# EasyEDA schematic CI_iCESDuck-ShieldControler.json

## Sheets
1 Connectors: TITLE: Connectors; REV: 1.0; Date: 2023-12-20; Sheet: 0/6; Drawn By: Daniel Fuentes Morales; Company: iCESDuck
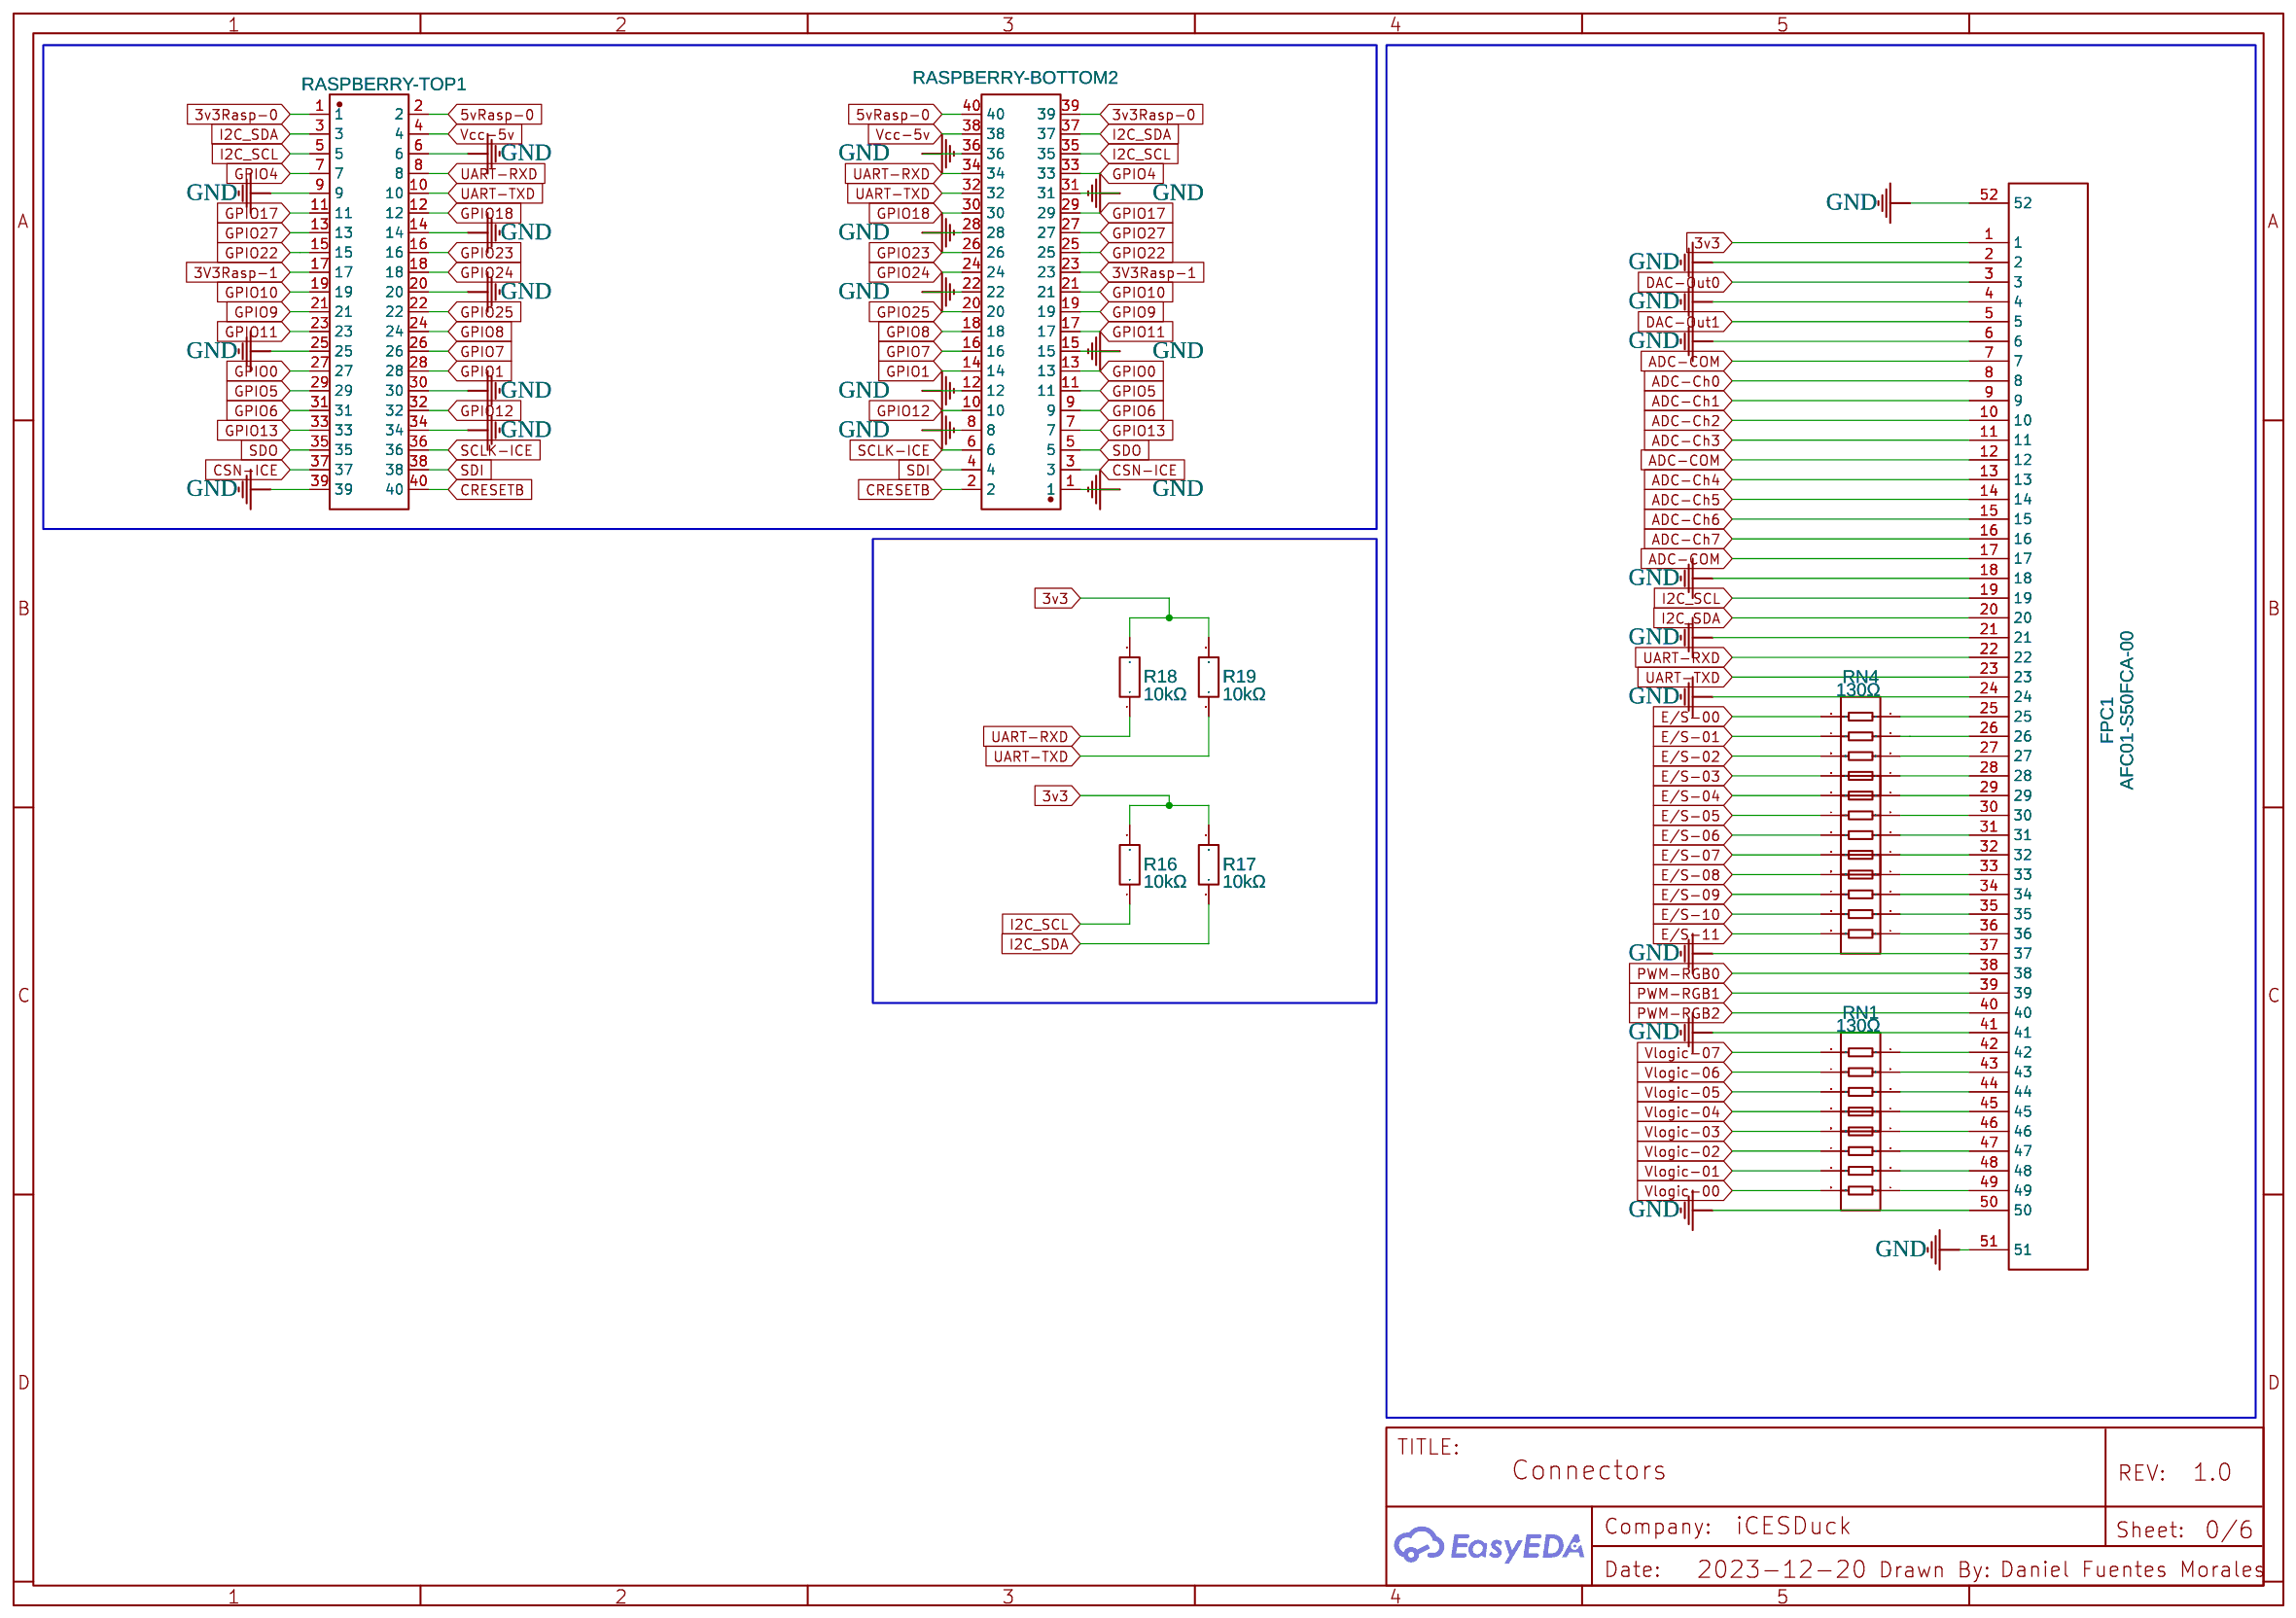
[diagram p0: Connectors]
2 power supply: TITLE: Power Supply; Date: 2023-12-21; Sheet: 1/1
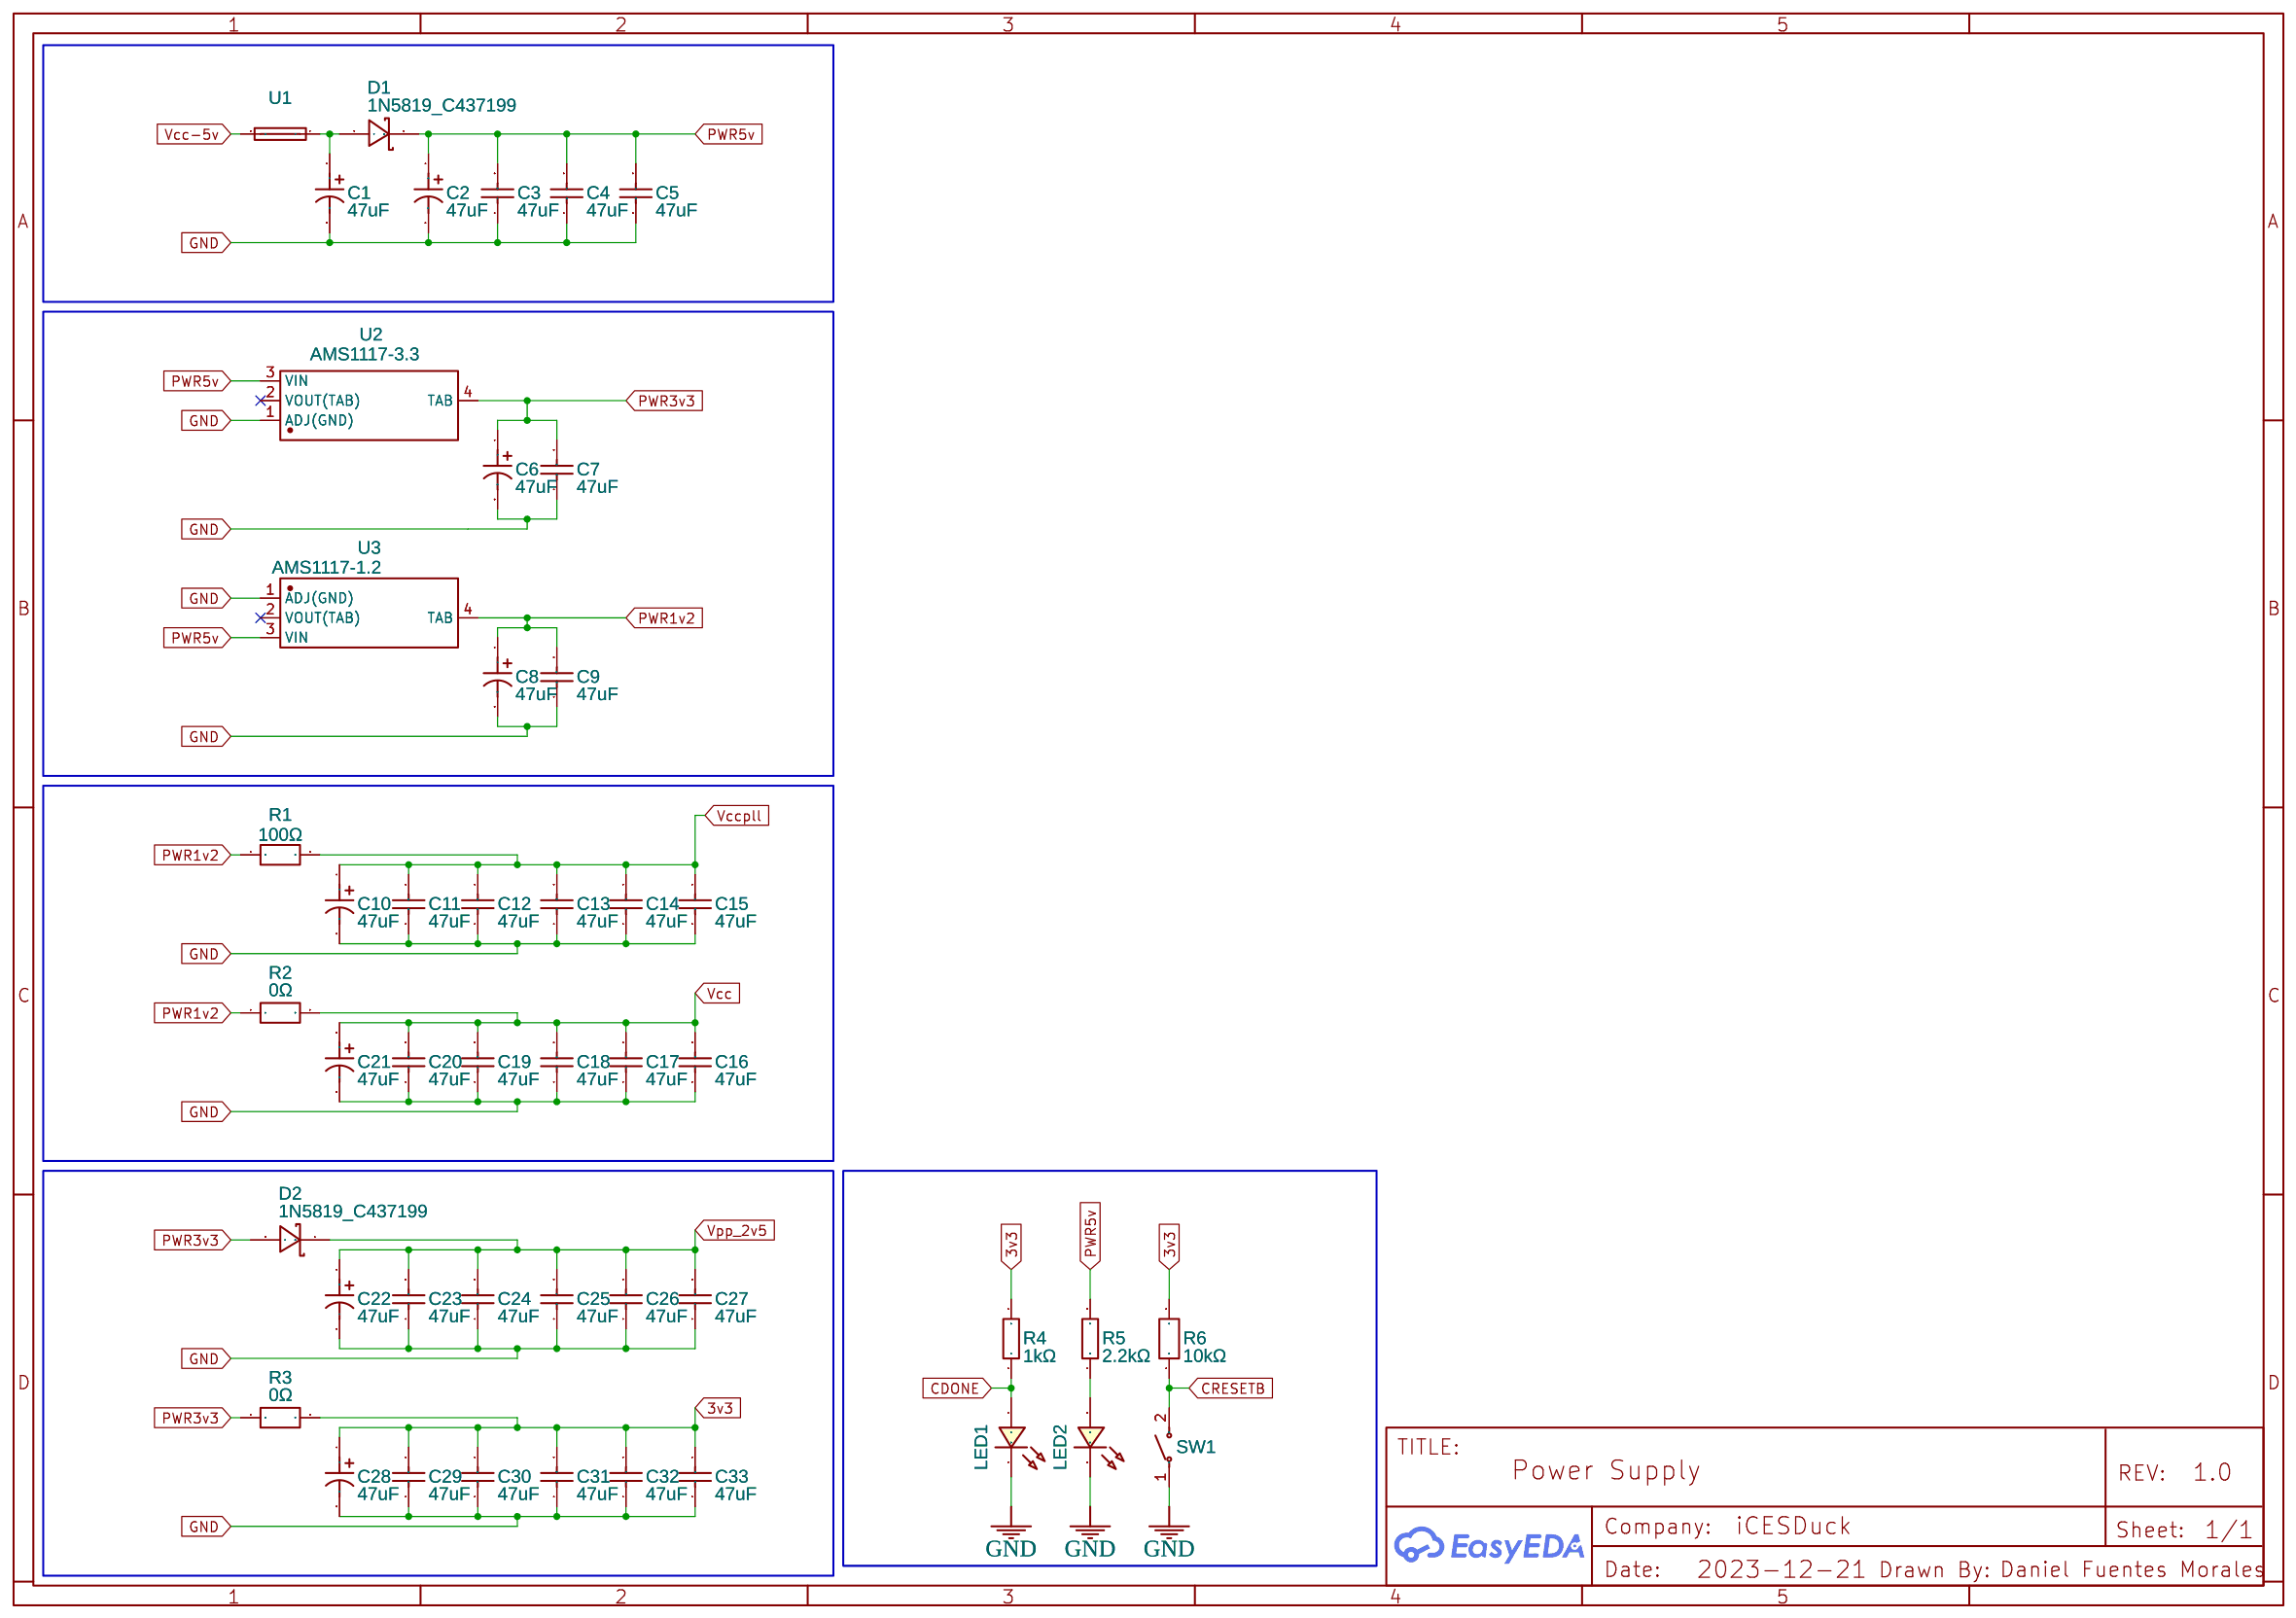
[diagram p1: power supply]
3 FPGA - iCE40UP5k: TITLE: FPGA - iCE40UP5K; Date: 2023-12-21; Sheet: 1/1
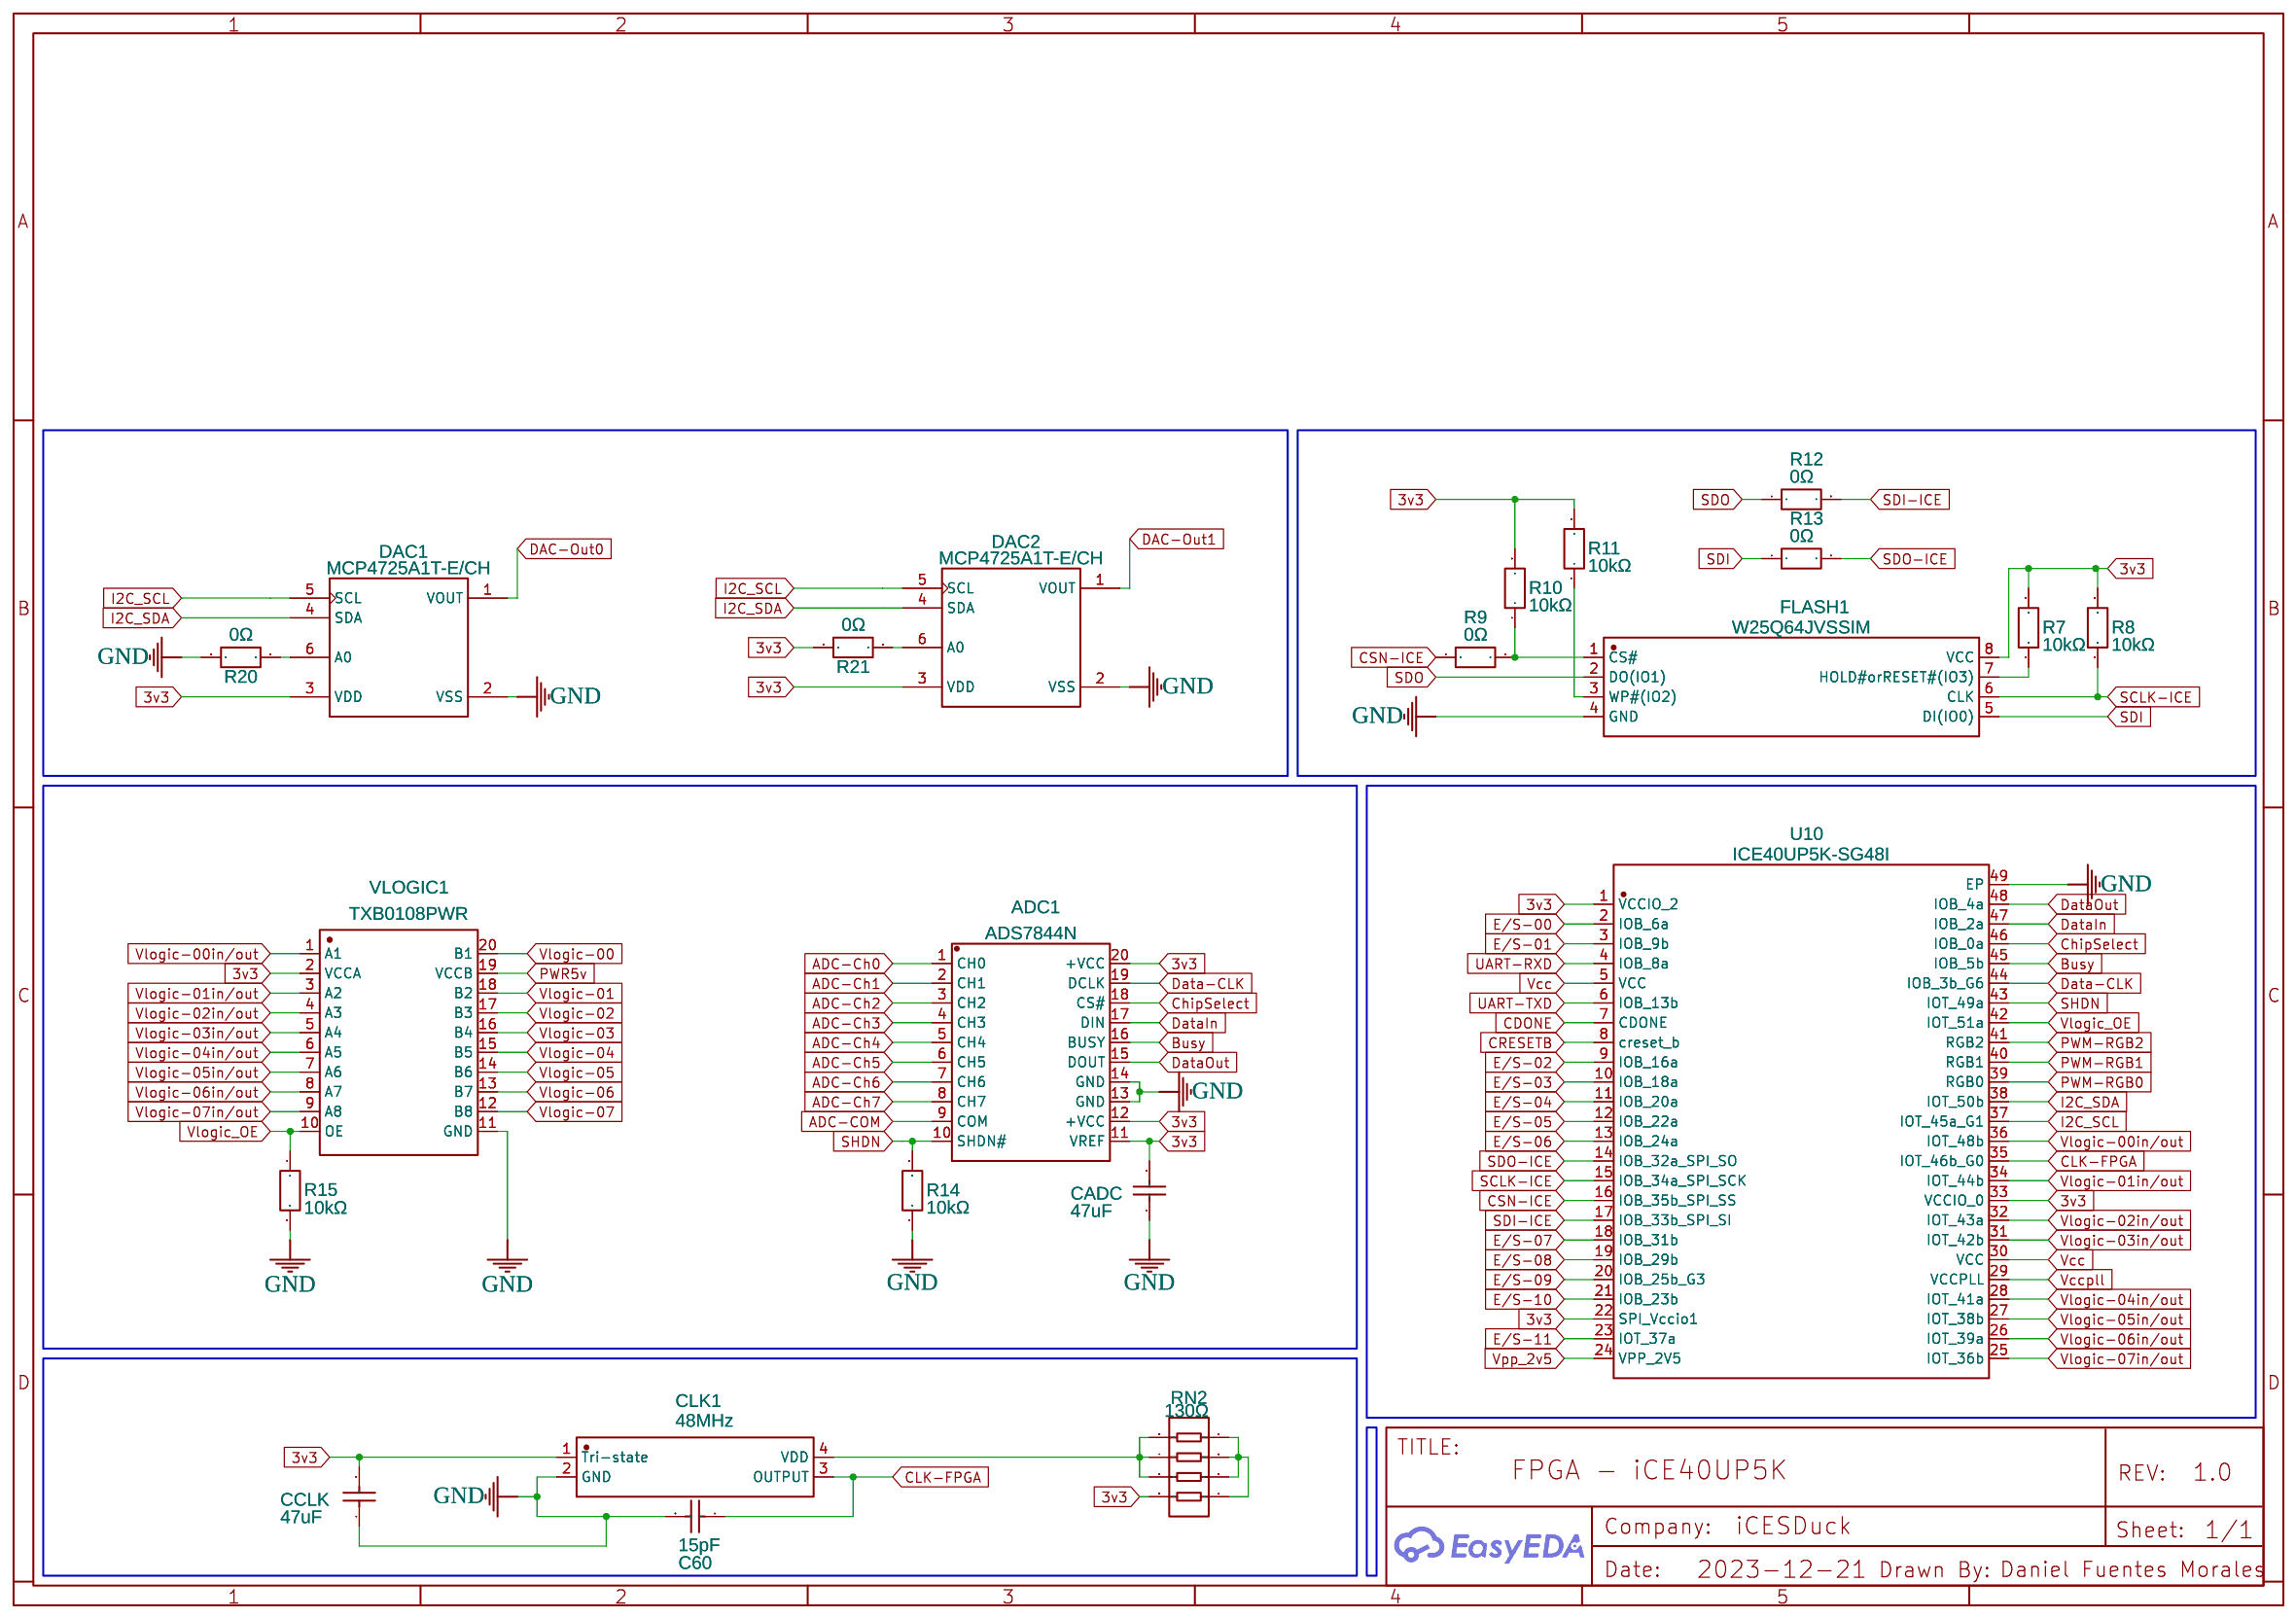
[diagram p2: FPGA - iCE40UP5k]

## Parts
sheet Connectors
FPC1  AFC01-S50FCA-00  [FPC-SMD_AFC01-S50FCC-00]
R16  10kΩ  [R1206]
R17  10kΩ  [R1206]
R18  10kΩ  [R1206]
R19  10kΩ  [R1206]
RASPBERRY-BOTTOM2  FH-00148  [HDR-SMD_40P-P2.54-V-F-R2-C20-S7.1-EH]
RASPBERRY-TOP1  FH-00148  [HDR-SMD_40P-P2.54-V-F-R2-C20-S7.1-EH]
RN1  130Ω  [RES-ARRAY-SMD_0603-8P-L3.2-W1.6-BL]
RN3  130Ω  [RES-ARRAY-SMD_0603-8P-L3.2-W1.6-BL]
RN4  130Ω  [RES-ARRAY-SMD_0603-8P-L3.2-W1.6-BL]
RN5  130Ω  [RES-ARRAY-SMD_0603-8P-L3.2-W1.6-BL]
RN6  130Ω  [RES-ARRAY-SMD_0603-8P-L3.2-W1.6-BL]
sheet FPGA - iCE40UP5k
ADC1  ADS7844N  [SSOP-20_L7.2-W5.3-P0.65-LS7.8-BL]
C60  15pF  [C0603]
CADC  47uF  [C0805]
CCLK  47uF  [C0805]
CLK1  48MHz  [OSC-SMD_4P-L3.2-W2.5-BL_SIT8008BI]
DAC1  MCP4725A1T-E/CH  [SOT-23-6_L2.9-W1.6-P0.95-LS2.8-BR]
DAC2  MCP4725A1T-E/CH  [SOT-23-6_L2.9-W1.6-P0.95-LS2.8-BR]
FLASH1  W25Q64JVSSIM  [SOIC-8_L5.2-W5.2-P1.27-LS8.0-BL]
R7  10kΩ  [R1206]
R8  10kΩ  [R1206]
R9  0Ω  [R0805]
R10  10kΩ  [R1206]
R11  10kΩ  [R1206]
R12  0Ω  [R0805]
R13  0Ω  [R0805]
R14  10kΩ  [R1206]
R15  10kΩ  [R1206]
R20  0Ω  [R0805]
R21  0Ω  [R0805]
RN2  130Ω  [RES-ARRAY-SMD_0603-8P-L3.2-W1.6-BL]
U10  ICE40UP5K-SG48I  [QFN-48_L7.0-W7.0-P0.50-TL-EP5.4-1]
VLOGIC1  TXB0108PWR  [TSSOP-20_L6.5-W4.4-P0.65-LS6.4-BL]
sheet power supply
C1  47uF  [CAP-SMD_L3.2-W1.6]
C2  47uF  [CAP-SMD_L3.2-W1.6]
C3  47uF  [C0805]
C4  47uF  [C0805]
C5  47uF  [C0805]
C6  47uF  [CAP-SMD_L3.2-W1.6]
C7  47uF  [C0805]
C8  47uF  [CAP-SMD_L3.2-W1.6]
C9  47uF  [C0805]
C10  47uF  [CAP-SMD_L3.2-W1.6]
C11  47uF  [C0805]
C12  47uF  [C0805]
C13  47uF  [C0805]
C14  47uF  [C0805]
C15  47uF  [C0805]
C16  47uF  [C0805]
C17  47uF  [C0805]
C18  47uF  [C0805]
C19  47uF  [C0805]
C20  47uF  [C0805]
C21  47uF  [CAP-SMD_L3.2-W1.6]
C22  47uF  [CAP-SMD_L3.2-W1.6]
C23  47uF  [C0805]
C24  47uF  [C0805]
C25  47uF  [C0805]
C26  47uF  [C0805]
C27  47uF  [C0805]
C28  47uF  [CAP-SMD_L3.2-W1.6]
C29  47uF  [C0805]
C30  47uF  [C0805]
C31  47uF  [C0805]
C32  47uF  [C0805]
C33  47uF  [C0805]
D1  1N5819_C437199  [SMA_L4.4-W2.6-LS5.0-RD]
D2  1N5819_C437199  [SMA_L4.4-W2.6-LS5.0-RD]
LED1  LED-0603_G  [LED0603_GREEN]
LED2  LED-0603_G  [LED0603_GREEN]
R1  100Ω  [R0805]
R2  0Ω  [R0805]
R3  0Ω  [R0805]
R4  1kΩ  [R0603]
R5  2.2kΩ  [R0603]
R6  10kΩ  [R1206]
SW1  TS-1088R-02026  [SW-SMD_L3.9-W3.0-P4.45]
U1  0494001.NR  [F0603]
U2  AMS1117-3.3  [SOT-223-4_L6.5-W3.5-P2.30-LS7.0-BR]
U3  AMS1117-1.2  [SOT-223_L6.7-W3.5-P2.30-BR]

## Library data of the parts
FPC1 = AFC01-S50FCA-00: Contributor: LCSC; Supplier: LCSC; Supplier Part: C262676; Manufacturer: JS(钜硕电子); JLCPCB Part Class: Extended Part; link: https://lcsc.com/eda_search?q=C262676&%26type=1&ref=editor
R6-R8 R10 R11 R14-R19 = FRP1206J103 TS: Contributor: lcsc; Supplier: LCSC; Supplier Part: C3013377; Manufacturer: FOJAN(富捷); link: https://lcsc.com/eda_search?q=C3013377&%26type=1&ref=editor
RASPBERRY-BOTTOM2 RASPBERRY-TOP1 = FH-00148: Contributor: LCSC; Supplier: LCSC; Supplier Part: C2685092; Manufacturer: Liansheng(连盛); JLCPCB Part Class: Extended Part; link: https://lcsc.com/eda_search?q=C2685092&%26type=1&ref=editor
RN1-RN6 = 4D03WGJ0131T5E: Contributor: LCSC; Supplier: LCSC; Supplier Part: C425191; Manufacturer: UNI-ROYAL(厚声); JLCPCB Part Class: Extended Part; link: https://lcsc.com/eda_search?q=C425191&%26type=1&ref=editor
ADC1 = ADS7844N: Contributor: LCSC; Supplier: LCSC; Supplier Part: C52610; Manufacturer: TI(德州仪器); JLCPCB Part Class: Extended Part; link: https://lcsc.com/eda_search?q=C52610&%26type=1&ref=editor
C60 = CL10C150JB8NNNC: Supplier: LCSC; Manufacturer: SAMSUNG(三星); Supplier Part: C1644; JLCPCB Part Class: Basic Part; link: https://lcsc.com/eda_search?q=C1644&%26type=1&ref=editor
C3-C5 C7 C9 C11-C20 C23-C27 C29-C33 CADC CCLK = C2012X5R1A476MTJ00E: Supplier: LCSC; Manufacturer: TDK; Supplier Part: C76636; JLCPCB Part Class: Extended Part; link: https://lcsc.com/eda_search?q=C76636&%26type=1&ref=editor
CLK1 = S3D48.000000B20F30T: Contributor: LCSC; Supplier: LCSC; Supplier Part: C387440; Manufacturer: SCTF(星通时频); JLCPCB Part Class: Extended Part; link: https://lcsc.com/eda_search?q=C387440&%26type=1&ref=editor
DAC1 DAC2 = MCP4725A1T-E/CH: Supplier: LCSC; Manufacturer: MICROCHIP(美国微芯); Supplier Part: C61423; JLCPCB Part Class: Extended Part; link: https://lcsc.com/eda_search?q=C61423&%26type=1&ref=editor
FLASH1 = W25Q64JVSSIM: Contributor: lcsc; Supplier: LCSC; Supplier Part: C5362615; Manufacturer: WINBOND(华邦); JLCPCB Part Class: Extended Part; link: https://lcsc.com/eda_search?q=C5362615&%26type=1&ref=editor
R1-R3 R9 R12 R13 R20 R21 = AS05W2J0102T5E: Contributor: LCSC; Supplier: LCSC; Supplier Part: C560481; Manufacturer: UNI-ROYAL(厚声); JLCPCB Part Class: Extended Part; link: https://lcsc.com/eda_search?q=C560481&%26type=1&ref=editor
U10 = ICE40UP5K-SG48I: Contributor: LCSC; Supplier: LCSC; Supplier Part: C2678152; Manufacturer: LATTICE(莱迪思); JLCPCB Part Class: Extended Part; link: https://lcsc.com/eda_search?q=C2678152&%26type=1&ref=editor
VLOGIC1 = TXB0108PWR: Supplier: LCSC; Manufacturer: TI(德州仪器); Supplier Part: C53406; JLCPCB Part Class: Extended Part; link: https://lcsc.com/eda_search?q=C53406&%26type=1&ref=editor
C1 C2 C6 C8 C10 C21 C22 C28 = CA45-A-10V-47UF-M: Contributor: LCSC; Supplier: LCSC; Supplier Part: C688949; Manufacturer: CEC(振华新云); Manufacturer Part: CA45-A-10V-47uF-M; JLCPCB Part Class: Extended Part; link: https://lcsc.com/eda_search?q=C688949&%26type=1&ref=editor
D1 D2 = 1N5819_C437199: Contributor: LCSC; Supplier: LCSC; Supplier Part: C437199; Manufacturer: KEXIN(科信); Manufacturer Part: 1N5819; JLCPCB Part Class: Extended Part; link: https://lcsc.com/eda_search?q=C437199&%26type=1&ref=editor
LED1 LED2 = LED-0603_G: Manufacturer: EVERLIGHT(台湾亿光); Manufacturer Part: 19-217/GHC-YR1S2/3T; Supplier Part: C72043; Supplier: LCSC; Contributor: LCEDA_Lib
R4 = 0603WAF1001T5E: Supplier: LCSC; Manufacturer: UNI-ROYAL(厚声); Supplier Part: C21190; JLCPCB Part Class: Basic Part; link: https://lcsc.com/eda_search?q=C21190&%26type=1&ref=editor
R5 = 0603WAF2201T5E: Supplier: LCSC; Manufacturer: UNI-ROYAL(厚声); Supplier Part: C4190; JLCPCB Part Class: Basic Part; link: https://lcsc.com/eda_search?q=C4190&%26type=1&ref=editor
SW1 = TS-1088R-02026: Contributor: LCSC; Supplier: LCSC; Supplier Part: C455280; Manufacturer: XUNPU(讯普); JLCPCB Part Class: Extended Part; link: https://lcsc.com/eda_search?q=C455280&%26type=1&ref=editor
U1 = 0494001.NR: Contributor: LCSC; Supplier: LCSC; Supplier Part: C142652; Manufacturer: Littelfuse(美国力特); JLCPCB Part Class: Extended Part; link: https://lcsc.com/eda_search?q=C142652&%26type=1&ref=editor
U2 = AMS1117-3.3_C347222: Contributor: LCSC; Supplier: LCSC; Supplier Part: C347222; Manufacturer: UMW(广东友台半导体); JLCPCB Part Class: Extended Part; link: https://lcsc.com/eda_search?q=C347222&%26type=1&ref=editor
U3 = AMS1117-1.2_C347218: Contributor: LCSC; Supplier: LCSC; Supplier Part: C347218; Manufacturer: UMW(广东友台半导体); JLCPCB Part Class: Extended Part; link: https://lcsc.com/eda_search?q=C347218&%26type=1&ref=editor

## Nets
3v3: ADC1.11(VREF) ADC1.12(+VCC) ADC1.20(+VCC) C28.1 C29.2 C30.2 C31.2 C32.2 C33.2 CADC.2 CCLK.2 CLK1.1(Tri-state) DAC1.3(VDD) DAC2.3(VDD) FLASH1.8(VCC) FPC1.1 R3.2 R4.2 R6.2 R7.2 R8.2 R10.2 R11.2 R16.2 R17.2 R18.2 R19.2 R21.1 RN2.5 U10.1(VCCIO_2) U10.22(SPI_Vccio1) U10.33(VCCIO_0) VLOGIC1.2(VCCA)
3v3Rasp-0: RASPBERRY-BOTTOM2.39 RASPBERRY-TOP1.1
3V3Rasp-1: RASPBERRY-BOTTOM2.23 RASPBERRY-TOP1.17
5vRasp-0: RASPBERRY-BOTTOM2.40 RASPBERRY-TOP1.2
GND: ADC1.13(GND) ADC1.14(GND) C1.2 C2.2 C3.1 C4.1 C5.1 C6.2 C7.1 C8.2 C9.1 C10.2 C11.1 C12.1 C13.1 C14.1 C15.1 C16.1 C17.1 C18.1 C19.1 C20.1 C21.2 C22.2 C23.1 C24.1 C25.1 C26.1 C27.1 C28.2 C29.1 C30.1 C31.1 C32.1 C33.1 C60.2 CADC.1 CCLK.1 CLK1.2(GND) DAC1.2(VSS) DAC2.2(VSS) FLASH1.4(GND) FPC1.2 FPC1.4 FPC1.6 FPC1.18 FPC1.21 FPC1.24 FPC1.37 FPC1.41 FPC1.50 FPC1.51 FPC1.52 LED1.2 LED2.2 R14.1 R15.2 R20.1 RASPBERRY-BOTTOM2.1 RASPBERRY-BOTTOM2.8 RASPBERRY-BOTTOM2.12 RASPBERRY-BOTTOM2.15 RASPBERRY-BOTTOM2.22 RASPBERRY-BOTTOM2.28 RASPBERRY-BOTTOM2.31 RASPBERRY-BOTTOM2.36 RASPBERRY-TOP1.6 RASPBERRY-TOP1.9 RASPBERRY-TOP1.14 RASPBERRY-TOP1.20 RASPBERRY-TOP1.25 RASPBERRY-TOP1.30 RASPBERRY-TOP1.34 RASPBERRY-TOP1.39 SW1.1 U2.1(ADJ(GND)) U3.1(ADJ(GND)) U10.49(EP) VLOGIC1.11(GND)
Vcc: C16.2 C17.2 C18.2 C19.2 C20.2 C21.1 R2.2 U10.5(VCC) U10.30(VCC)
Vcc-5v: RASPBERRY-BOTTOM2.38 RASPBERRY-TOP1.4 U1.2
Vccpll: C10.1 C11.2 C12.2 C13.2 C14.2 C15.2 R1.2 U10.29(VCCPLL)
ADC-Ch0: ADC1.1(CH0) FPC1.8
ADC-Ch1: ADC1.2(CH1) FPC1.9
ADC-Ch2: ADC1.3(CH2) FPC1.10
ADC-Ch3: ADC1.4(CH3) FPC1.11
ADC-Ch4: ADC1.5(CH4) FPC1.13
ADC-Ch5: ADC1.6(CH5) FPC1.14
ADC-Ch6: ADC1.7(CH6) FPC1.15
ADC-Ch7: ADC1.8(CH7) FPC1.16
ADC-COM: ADC1.9(COM) FPC1.7 FPC1.12 FPC1.17
Busy: ADC1.16(BUSY) U10.45(IOB_5b)
CDONE: LED1.1 R4.1 U10.7(CDONE)
ChipSelect: ADC1.18(CS#) U10.46(IOB_0a)
CLK-FPGA: C60.1 CLK1.3(OUTPUT) U10.35(IOT_46b_G0)
CRESETB: R6.1 RASPBERRY-BOTTOM2.2 RASPBERRY-TOP1.40 SW1.2 U10.8(creset_b)
CSN-ICE: R9.1 RASPBERRY-BOTTOM2.3 RASPBERRY-TOP1.37 U10.16(IOB_35b_SPI_SS)
DAC-Out0: DAC1.1(VOUT) FPC1.3
DAC-Out1: DAC2.1(VOUT) FPC1.5
Data-CLK: ADC1.19(DCLK) U10.44(IOB_3b_G6)
DataIn: ADC1.17(DIN) U10.47(IOB_2a)
DataOut: ADC1.15(DOUT) U10.48(IOB_4a)
E/S-00: RN4.8 U10.2(IOB_6a)
E/S-01: RN4.7 U10.3(IOB_9b)
E/S-02: RN4.6 U10.9(IOB_16a)
E/S-03: RN4.5 U10.10(IOB_18a)
E/S-04: RN5.8 U10.11(IOB_20a)
E/S-05: RN5.7 U10.12(IOB_22a)
E/S-06: RN5.6 U10.13(IOB_24a)
E/S-07: RN5.5 U10.18(IOB_31b)
E/S-08: RN6.8 U10.19(IOB_29b)
E/S-09: RN6.7 U10.20(IOB_25b_G3)
E/S-10: RN6.6 U10.21(IOB_23b)
E/S-11: RN6.5 U10.23(IOT_37a)
GPIO0: RASPBERRY-BOTTOM2.13 RASPBERRY-TOP1.27
GPIO1: RASPBERRY-BOTTOM2.14 RASPBERRY-TOP1.28
GPIO4: RASPBERRY-BOTTOM2.33 RASPBERRY-TOP1.7
GPIO5: RASPBERRY-BOTTOM2.11 RASPBERRY-TOP1.29
GPIO6: RASPBERRY-BOTTOM2.9 RASPBERRY-TOP1.31
GPIO7: RASPBERRY-BOTTOM2.16 RASPBERRY-TOP1.26
GPIO8: RASPBERRY-BOTTOM2.18 RASPBERRY-TOP1.24
GPIO9: RASPBERRY-BOTTOM2.19 RASPBERRY-TOP1.21
GPIO10: RASPBERRY-BOTTOM2.21 RASPBERRY-TOP1.19
GPIO11: RASPBERRY-BOTTOM2.17 RASPBERRY-TOP1.23
GPIO12: RASPBERRY-BOTTOM2.10 RASPBERRY-TOP1.32
GPIO13: RASPBERRY-BOTTOM2.7 RASPBERRY-TOP1.33
GPIO17: RASPBERRY-BOTTOM2.29 RASPBERRY-TOP1.11
GPIO18: RASPBERRY-BOTTOM2.30 RASPBERRY-TOP1.12
GPIO22: RASPBERRY-BOTTOM2.25 RASPBERRY-TOP1.15
GPIO23: RASPBERRY-BOTTOM2.26 RASPBERRY-TOP1.16
GPIO24: RASPBERRY-BOTTOM2.24 RASPBERRY-TOP1.18
GPIO25: RASPBERRY-BOTTOM2.20 RASPBERRY-TOP1.22
GPIO27: RASPBERRY-BOTTOM2.27 RASPBERRY-TOP1.13
I2C_SCL: DAC1.5(SCL) DAC2.5(SCL) FPC1.19 R16.1 RASPBERRY-BOTTOM2.35 RASPBERRY-TOP1.5 U10.37(IOT_45a_G1)
I2C_SDA: DAC1.4(SDA) DAC2.4(SDA) FPC1.20 R17.1 RASPBERRY-BOTTOM2.37 RASPBERRY-TOP1.3 U10.38(IOT_50b)
PWM-RGB0: FPC1.38 U10.39(RGB0)
PWM-RGB1: FPC1.39 U10.40(RGB1)
PWM-RGB2: FPC1.40 U10.41(RGB2)
PWR1v2: C8.1 C9.2 R1.1 R2.1 U3.4(TAB)
PWR3v3: C6.1 C7.2 D2.2(A) R3.1 U2.4(TAB)
PWR5v: C2.1 C3.2 C4.2 C5.2 D1.1(C) R5.2 U2.3(VIN) U3.3(VIN) VLOGIC1.19(VCCB)
SCLK-ICE: FLASH1.6(CLK) R8.1 RASPBERRY-BOTTOM2.6 RASPBERRY-TOP1.36 U10.15(IOB_34a_SPI_SCK)
SDI: FLASH1.5(DI(IO0)) R13.1 RASPBERRY-BOTTOM2.4 RASPBERRY-TOP1.38
SDI-ICE: R12.2 U10.17(IOB_33b_SPI_SI)
SDO: FLASH1.2(DO(IO1)) R12.1 RASPBERRY-BOTTOM2.5 RASPBERRY-TOP1.35
SDO-ICE: R13.2 U10.14(IOB_32a_SPI_SO)
SHDN: ADC1.10(SHDN#) R14.2 U10.43(IOT_49a)
UART-RXD: FPC1.22 R18.1 RASPBERRY-BOTTOM2.34 RASPBERRY-TOP1.8 U10.4(IOB_8a)
UART-TXD: FPC1.23 R19.1 RASPBERRY-BOTTOM2.32 RASPBERRY-TOP1.10 U10.6(IOB_13b)
Vlogic-00: RN3.5 VLOGIC1.20(B1)
Vlogic-00in/out: U10.36(IOT_48b) VLOGIC1.1(A1)
Vlogic-01: RN3.6 VLOGIC1.18(B2)
Vlogic-01in/out: U10.34(IOT_44b) VLOGIC1.3(A2)
Vlogic-02: RN3.7 VLOGIC1.17(B3)
Vlogic-02in/out: U10.32(IOT_43a) VLOGIC1.4(A3)
Vlogic-03: RN3.8 VLOGIC1.16(B4)
Vlogic-03in/out: U10.31(IOT_42b) VLOGIC1.5(A4)
Vlogic-04: RN1.5 VLOGIC1.15(B5)
Vlogic-04in/out: U10.28(IOT_41a) VLOGIC1.6(A5)
Vlogic-05: RN1.6 VLOGIC1.14(B6)
Vlogic-05in/out: U10.27(IOT_38b) VLOGIC1.7(A6)
Vlogic-06: RN1.7 VLOGIC1.13(B7)
Vlogic-06in/out: U10.26(IOT_39a) VLOGIC1.8(A7)
Vlogic-07: RN1.8 VLOGIC1.12(B8)
Vlogic-07in/out: U10.25(IOT_36b) VLOGIC1.9(A8)
Vlogic_OE: R15.1 U10.42(IOT_51a) VLOGIC1.10(OE)
Vpp_2v5: C22.1 C23.2 C24.2 C25.2 C26.2 C27.2 D2.1(C) U10.24(VPP_2V5)
Net-(C1-1): C1.1 D1.2(A) U1.1
Net-(CLK1-4): CLK1.4(VDD) RN2.6 RN2.7 RN2.8
Net-(DAC1-6): DAC1.6(A0) R20.2
Net-(DAC2-6): DAC2.6(A0) R21.2
Net-(FLASH1-1): FLASH1.1(CS#) R9.2 R10.1
Net-(FLASH1-3): FLASH1.3(WP#(IO2)) R11.1
Net-(FLASH1-7): FLASH1.7(HOLD#orRESET#(IO3)) R7.1
Net-(FPC1-25): FPC1.25 RN4.1
Net-(FPC1-26): FPC1.26 RN4.2
Net-(FPC1-27): FPC1.27 RN4.3
Net-(FPC1-28): FPC1.28 RN4.4
Net-(FPC1-29): FPC1.29 RN5.1
Net-(FPC1-30): FPC1.30 RN5.2
Net-(FPC1-31): FPC1.31 RN5.3
Net-(FPC1-32): FPC1.32 RN5.4
Net-(FPC1-33): FPC1.33 RN6.1
Net-(FPC1-34): FPC1.34 RN6.2
Net-(FPC1-35): FPC1.35 RN6.3
Net-(FPC1-36): FPC1.36 RN6.4
Net-(FPC1-42): FPC1.42 RN1.1
Net-(FPC1-43): FPC1.43 RN1.2
Net-(FPC1-44): FPC1.44 RN1.3
Net-(FPC1-45): FPC1.45 RN1.4
Net-(FPC1-46): FPC1.46 RN3.1
Net-(FPC1-47): FPC1.47 RN3.2
Net-(FPC1-48): FPC1.48 RN3.3
Net-(FPC1-49): FPC1.49 RN3.4
Net-(LED2-1): LED2.1 R5.1
Net-(RN2-1): RN2.1 RN2.2 RN2.3 RN2.4

Not connected (* = marked no-connect by the designer): U2 2(VOUT(TAB))*; U3 2(VOUT(TAB))*
